# EAGLE design Project-PowerSwitch-005 (EAGLE 7.7.0)

## Sheet 1 of 3
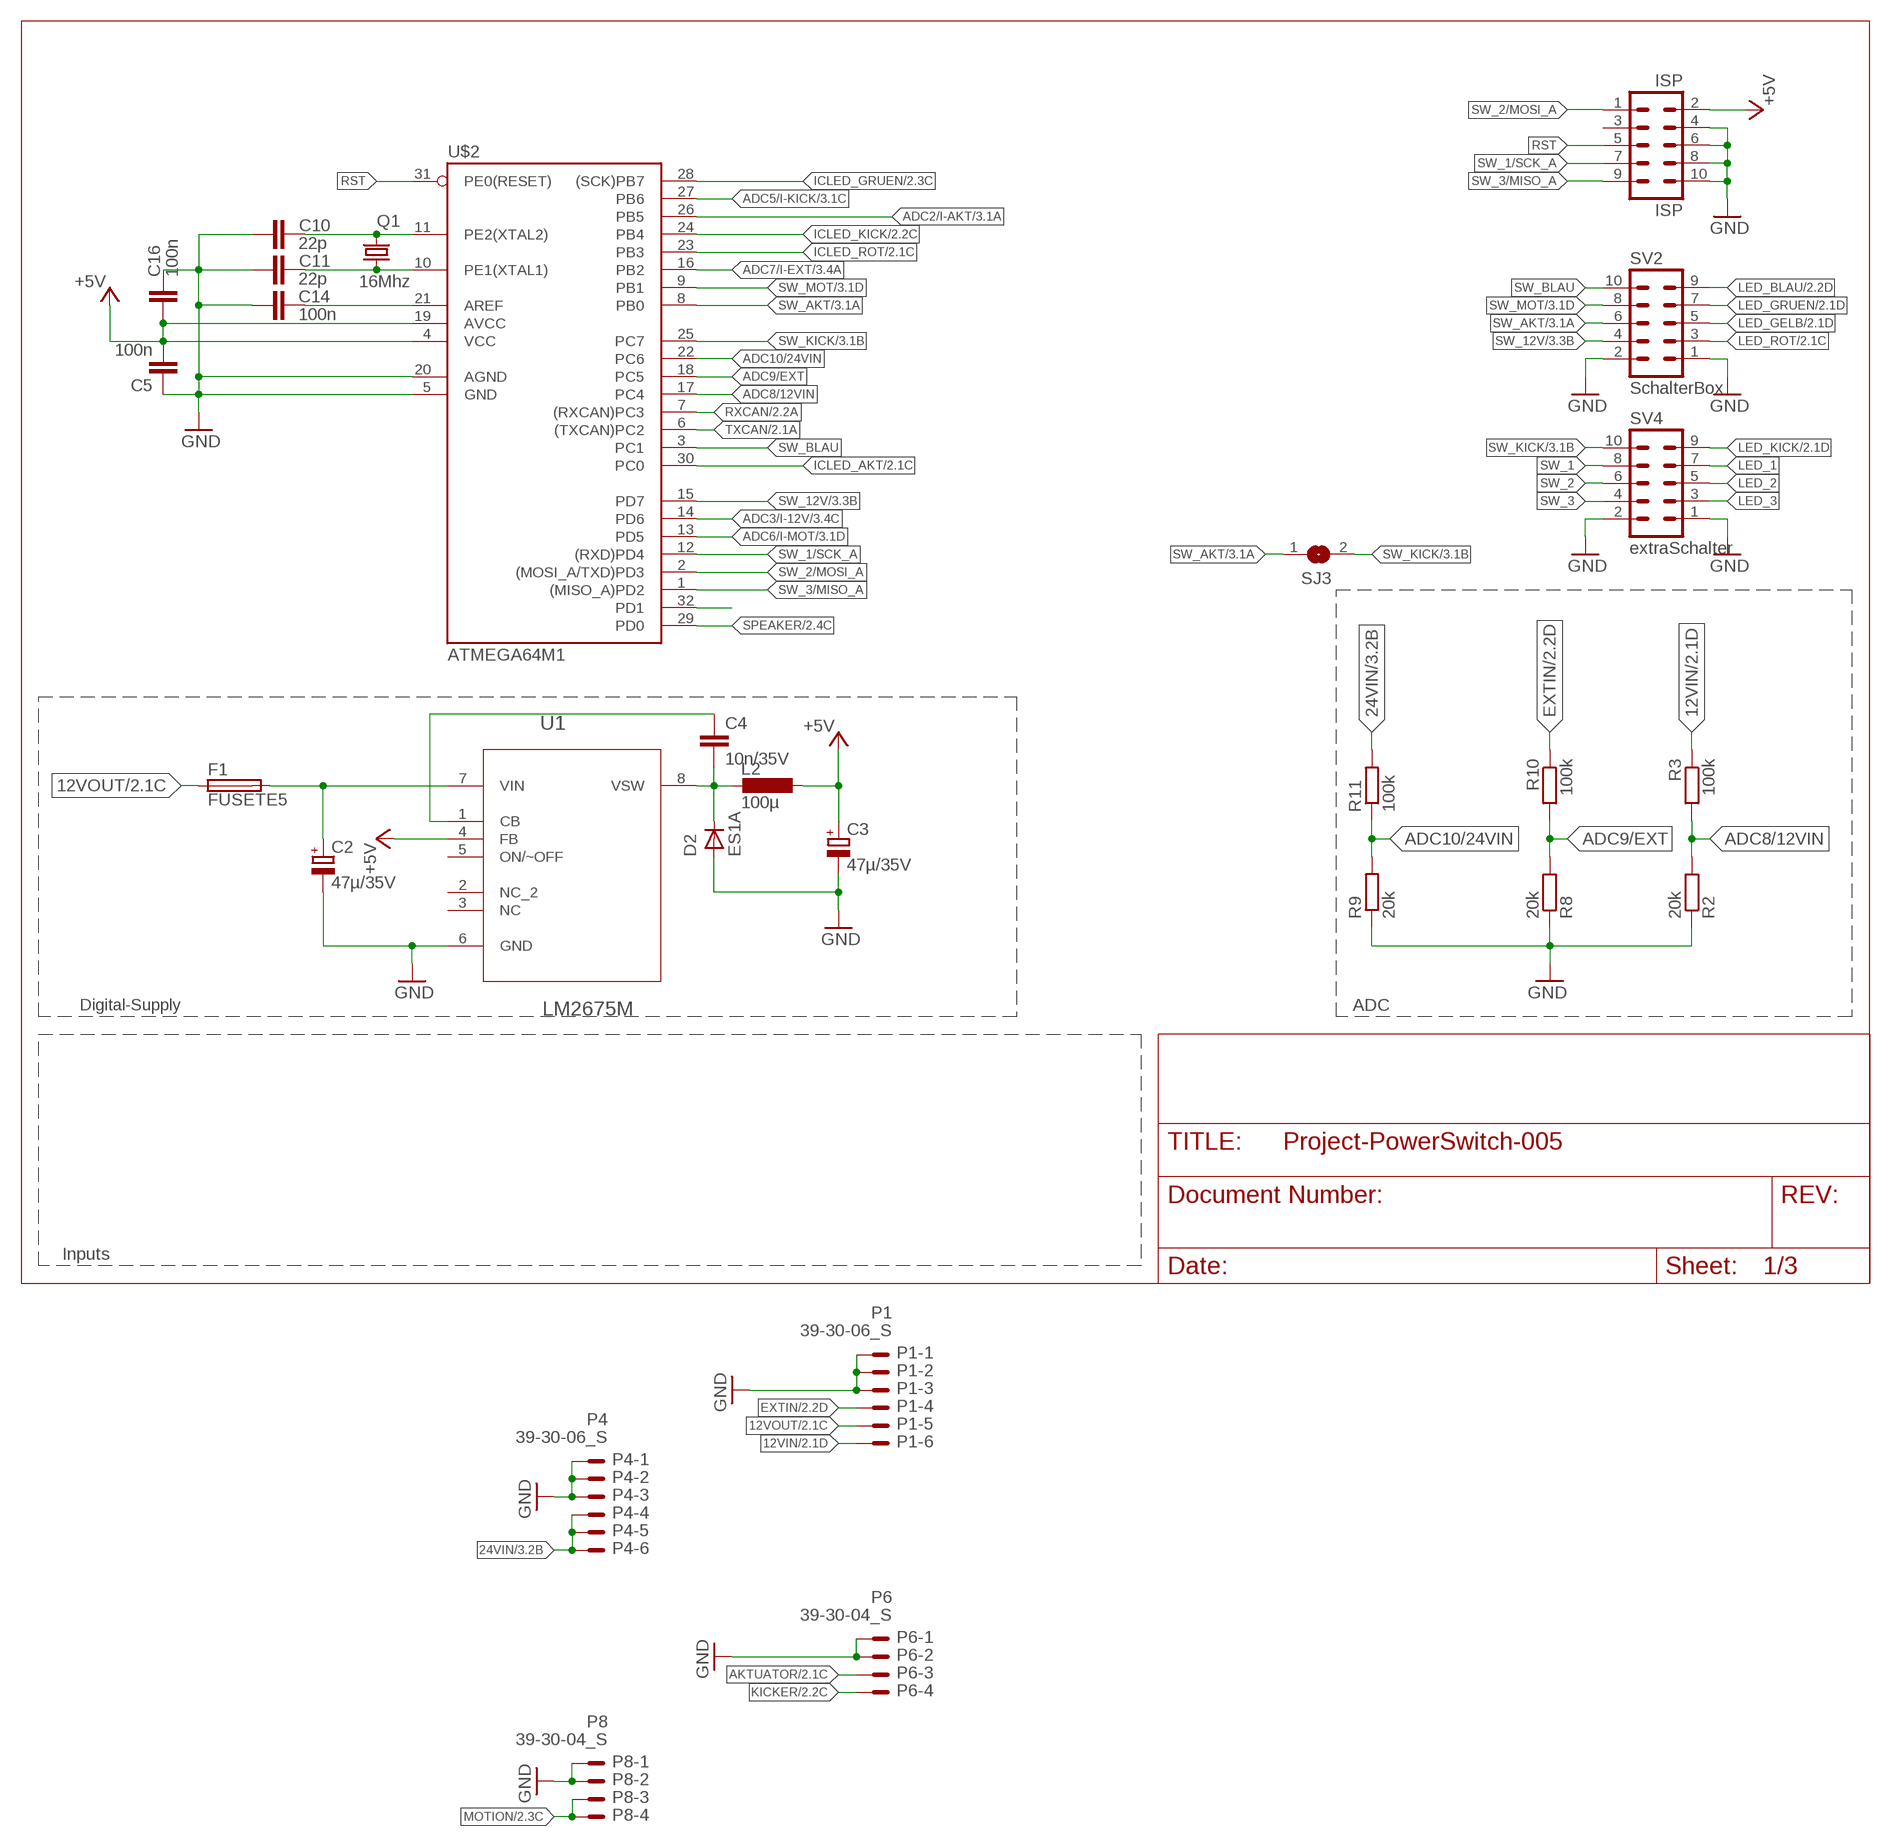
[diagram p0: schematic, sheet 1]

### Parts
C2  47µ/35V  CPOL-EUD  [PANASONIC_D]
C3  47µ/35V  CPOL-EUD  [PANASONIC_D]
C4  10n/35V  C-EUC0603  [C0603]
C5  100n  C-EUC0603  [C0603]
C10  22p  C-EUC0603  [C0603]
C11  22p  C-EUC0603  [C0603]
C14  100n  C-EUC0603  [C0603]
C16  100n  C-EUC0603  [C0603]
D2  ES1A  GF1  [SMA-DO214AC]
F1  FUSETE5  [TE5]
ISP  ISP  ML10  [ML10]
L2  100µ  L-EUPISM  [PISM]
P1  39-30-06_S  [39-30-?06?]
P4  39-30-06_S  [39-30-?06?]
P6  39-30-04_S  [39-30-?04?]
P8  39-30-04_S  [39-30-?04?]
Q1  16Mhz  CRYSTALHC49UP  [HC49UP]
R2  20k  R-EU_R0805  [R0805]
R3  100k  R-EU_R0805  [R0805]
R8  20k  R-EU_R0805  [R0805]
R9  20k  R-EU_R0805  [R0805]
R10  100k  R-EU_R0805  [R0805]
R11  100k  R-EU_R0805  [R0805]
SJ3  SJ  [SJ]
SV2  SchalterBox  ML10  [ML10]
SV4  extraSchalter  ML10  [ML10]
U1  LM2675M  LM2675M-3.3  [SOIC127P620X175-8N]
U$2  ATMEGA64M1  [TQFP32-08]

### Nets
12VIN: P1.6 R3.1 ; also sheet 2,3
12VOUT: F1.1 P1.5 ; also sheet 2,3
24VIN: P4.4 P4.5 P4.6 R11.2 ; also sheet 3
+5V: C3.+ C5.2 C16.1 ISP.2 L2.1 U1.4(FB) U$2.4(VCC) U$2.19(AVCC) ; also sheet 2
ADC2/I-AKT: U$2.26(PB5) ; also sheet 3
ADC3/I-12V: U$2.14(PD6) ; also sheet 3
ADC5/I-KICK: U$2.27(PB6) ; also sheet 3
ADC6/I-MOT: U$2.13(PD5) ; also sheet 3
ADC7/I-EXT: U$2.16(PB2) ; also sheet 3
ADC8/12VIN: R2.2 R3.2 U$2.17(PC4)
ADC9/EXT: R8.2 R10.2 U$2.18(PC5)
ADC10/24VIN: R9.2 R11.1 U$2.22(PC6)
AKTUATOR: P6.3 ; also sheet 2,3
EXTIN: P1.4 R10.1 ; also sheet 2,3
GND: C2.- C3.- C5.1 C10.1 C11.1 C14.1 C16.2 D2.A ISP.4 ISP.6 ISP.8 ISP.10 P1.1 P1.2 P1.3 P4.1 P4.2 P4.3 P6.1 P6.2 P8.1 P8.2 R2.1 R8.1 R9.1 SV2.1 SV2.2 SV4.1 SV4.2 U1.6(GND) U$2.5(GND) U$2.20(AGND) ; also sheet 2,3
ICLED_AKT: U$2.30(PC0) ; also sheet 2
ICLED_GRUEN: U$2.28((SCK)PB7) ; also sheet 2
ICLED_KICK: U$2.24(PB4) ; also sheet 2
ICLED_ROT: U$2.23(PB3) ; also sheet 2
KICKER: P6.4 ; also sheet 2,3
LED_1: SV4.7
LED_2: SV4.5
LED_3: SV4.3
LED_BLAU: SV2.9 ; also sheet 2
LED_GELB: SV2.5 ; also sheet 2
LED_GRUEN: SV2.7 ; also sheet 2
LED_KICK: SV4.9 ; also sheet 2
LED_ROT: SV2.3 ; also sheet 2
MOTION: P8.3 P8.4 ; also sheet 2,3
N$3: U$2.32(PD1)
N$10: C10.2 Q1.2 U$2.11(PE2(XTAL2))
N$11: C11.2 Q1.1 U$2.10(PE1(XTAL1))
N$13: C14.2 U$2.21(AREF)
N$22: C2.+ F1.2 U1.7(VIN)
N$27: C4.2 D2.K(C) L2.2 U1.8(VSW)
N$29: C4.1 U1.1(CB)
RST: ISP.5 U$2.31(PE0(RESET))
RXCAN: U$2.7((RXCAN)PC3) ; also sheet 2
SPEAKER: U$2.29(PD0) ; also sheet 2
SW_1: SV4.8
SW_1/SCK_A: ISP.7 U$2.12((RXD)PD4)
SW_2: SV4.6
SW_2/MOSI_A: ISP.1 U$2.2((MOSI_A/TXD)PD3)
SW_3: SV4.4
SW_3/MISO_A: ISP.9 U$2.1((MISO_A)PD2)
SW_12V: SV2.4 U$2.15(PD7) ; also sheet 3
SW_AKT: SJ3.1 SV2.6 U$2.8(PB0) ; also sheet 3
SW_BLAU: SV2.10 U$2.3(PC1)
SW_KICK: SJ3.2 SV4.10 U$2.25(PC7) ; also sheet 3
SW_MOT: SV2.8 U$2.9(PB1) ; also sheet 3
TXCAN: U$2.6((TXCAN)PC2) ; also sheet 2
Unconnected: ISP.3 U1.2(NC_2) U1.3(NC) U1.5(ON/~OFF)

### Notes on the sheet
- Digital-Supply | ADC
- Inputs

## Sheet 2 of 3
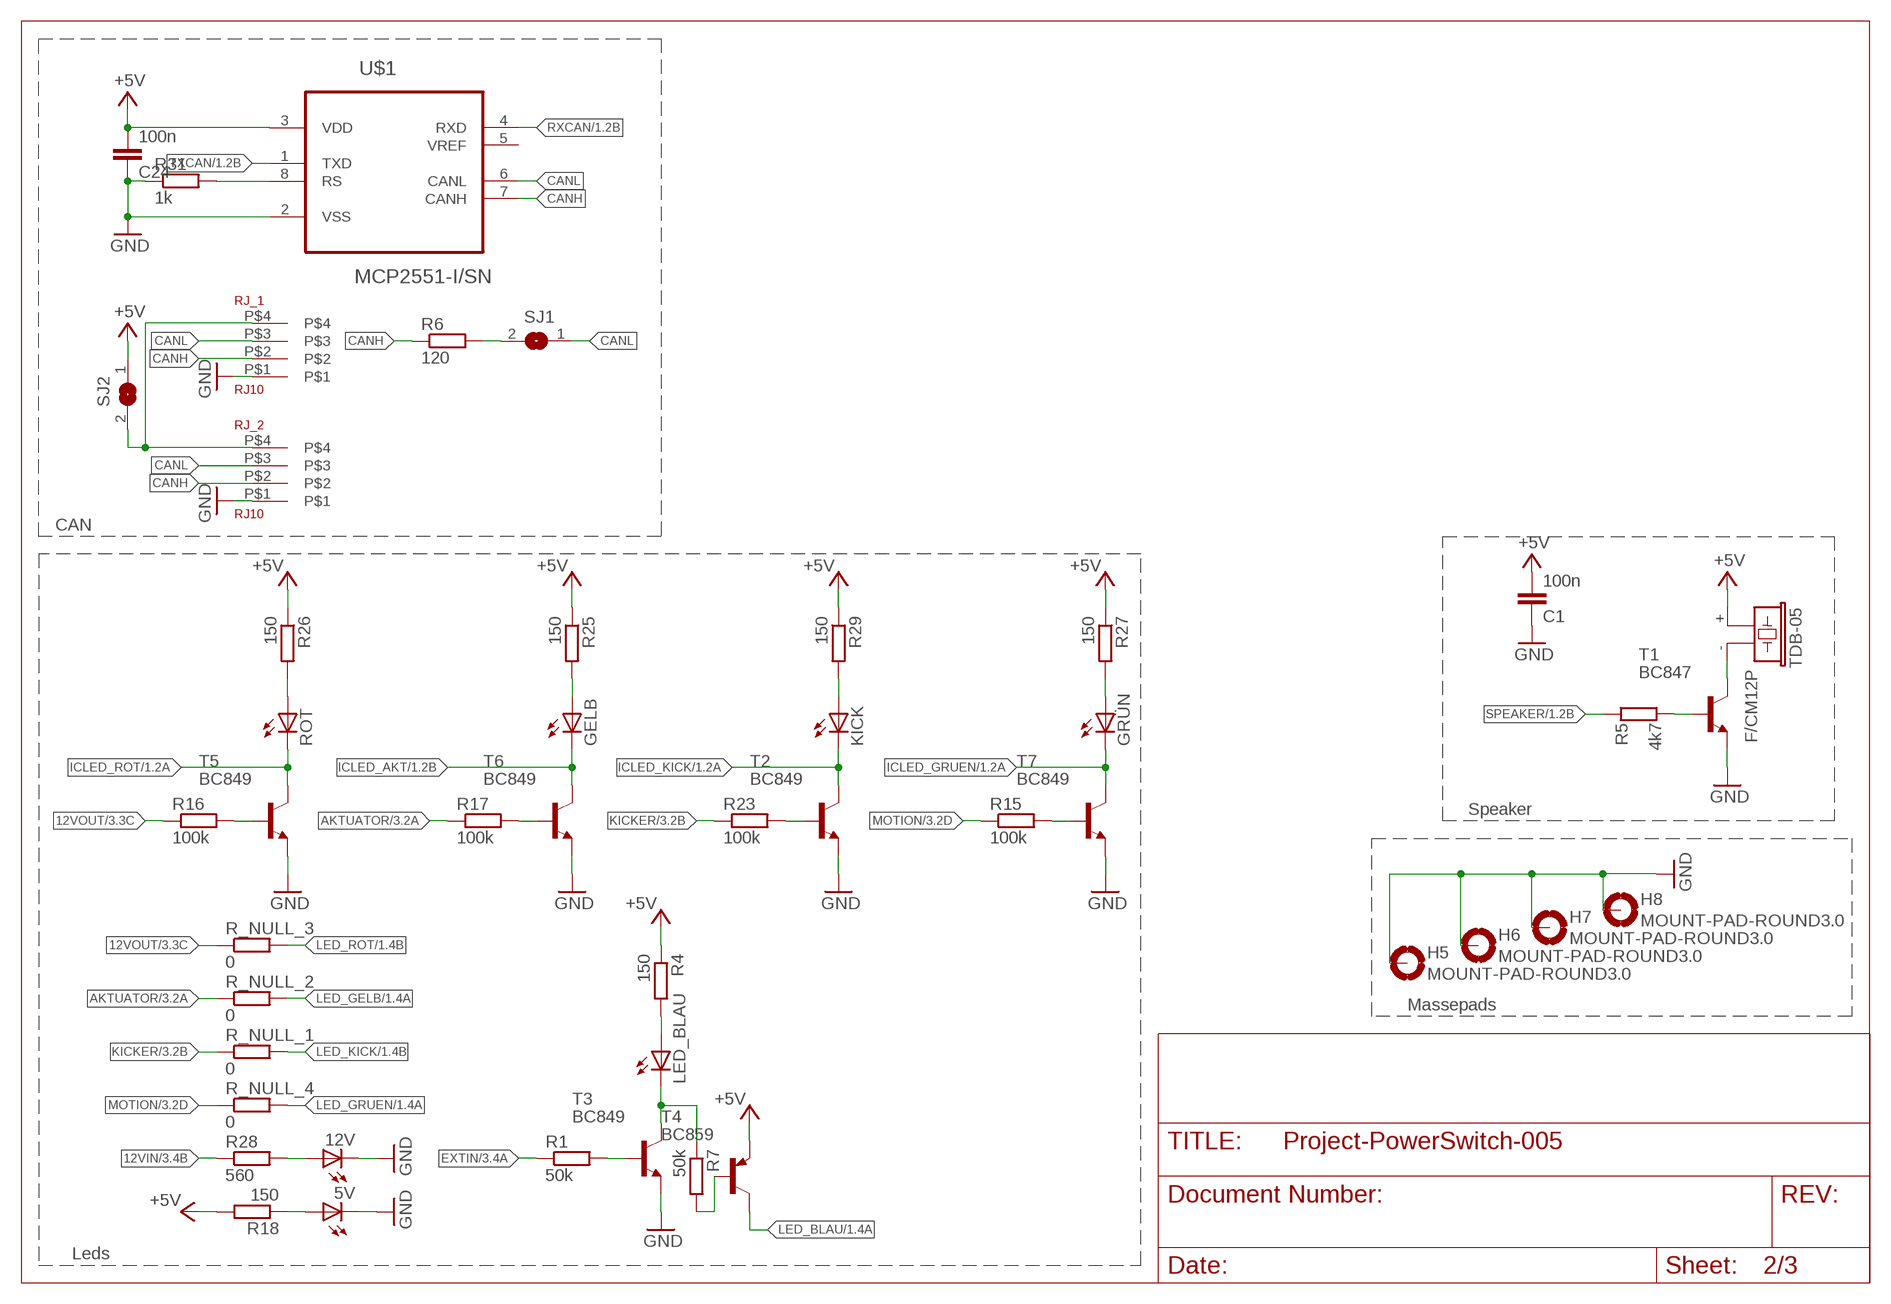
[diagram p1: schematic, sheet 2]

### Parts
5V  LEDCHIPLED_0805  [CHIPLED_0805]
12V  LEDCHIPLED_0805  [CHIPLED_0805]
C1  100n  C-EUC0603  [C0603]
C24  100n  C-EUC0603  [C0603]
GELB  LEDCHIPLED_0805  [CHIPLED_0805]
GRÜN  LEDCHIPLED_0805  [CHIPLED_0805]
H5  MOUNT-PAD-ROUND3.0  [3,0-PAD]
H6  MOUNT-PAD-ROUND3.0  [3,0-PAD]
H7  MOUNT-PAD-ROUND3.0  [3,0-PAD]
H8  MOUNT-PAD-ROUND3.0  [3,0-PAD]
KICK  LEDCHIPLED_0805  [CHIPLED_0805]
LED_BLAU  LEDCHIPLED_0805  [CHIPLED_0805]
R1  50k  R-EU_R0805  [R0805]
R4  150  R-EU_R0805  [R0805]
R5  4k7  R-EU_R0805  [R0805]
R6  120  R-EU_M0805  [M0805]
R7  50k  R-EU_R0805  [R0805]
R15  100k  R-EU_R0805  [R0805]
R16  100k  R-EU_R0805  [R0805]
R17  100k  R-EU_R0805  [R0805]
R18  150  R-EU_R0805  [R0805]
R23  100k  R-EU_R0805  [R0805]
R25  150  R-EU_R0805  [R0805]
R26  150  R-EU_R0805  [R0805]
R27  150  R-EU_R0805  [R0805]
R28  560  R-EU_R0805  [R0805]
R29  150  R-EU_R0805  [R0805]
R31  1k  R-EU_R0805  [R0805]
R_NULL_1  0  R-EU_R0402  [R0402]
R_NULL_2  0  R-EU_R0402  [R0402]
R_NULL_3  0  R-EU_R0402  [R0402]
R_NULL_4  0  R-EU_R0402  [R0402]
RJ_1  RJ10  [RJ10]
RJ_2  RJ10  [RJ10]
ROT  LEDCHIPLED_0805  [CHIPLED_0805]
SJ1  SJ  [SJ]
SJ2  SJ  [SJ]
T1  BC847  [SOT23]
T2  BC849  [SOT23]
T3  BC849  [SOT23]
T4  BC859  BC858C-PNP-SOT23-BEC  [SOT23-BEC]
T5  BC849  [SOT23]
T6  BC849  [SOT23]
T7  BC849  [SOT23]
TDB-05  F/CM12P  [F/CM12P]
U$1  MCP2551-I/SN  [SOIC127P600X175-8N]

### Nets
12VIN: R28.1 ; also sheet 1,3
12VOUT: R16.1 R_NULL_3.1 ; also sheet 1,3
+5V: C1.2 C24.2 R4.1 R18.2 R25.1 R26.1 R27.1 R29.1 SJ2.1 T4.E TDB-05.+ U$1.3(VDD) ; also sheet 1
AKTUATOR: R17.1 R_NULL_2.1 ; also sheet 1,3
CANH: R6.1 RJ_1.P$2 RJ_2.P$2 U$1.7(CANH)
CANL: RJ_1.P$3 RJ_2.P$3 SJ1.1 U$1.6(CANL)
EXTIN: R1.1 ; also sheet 1,3
GND: 5V.C 12V.C C1.1 C24.1 H5.B3,0(MOUNT) H6.B3,0(MOUNT) H7.B3,0(MOUNT) H8.B3,0(MOUNT) R31.1 RJ_1.P$1 RJ_2.P$1 T1.2(E) T2.2(E) T3.2(E) T5.2(E) T6.2(E) T7.2(E) U$1.2(VSS) ; also sheet 1,3
ICLED_AKT: GELB.C T6.3(C) ; also sheet 1
ICLED_GRUEN: GRÜN.C T7.3(C) ; also sheet 1
ICLED_KICK: KICK.C T2.3(C) ; also sheet 1
ICLED_ROT: ROT.C T5.3(C) ; also sheet 1
KICKER: R23.1 R_NULL_1.1 ; also sheet 1,3
LED_BLAU: T4.C ; also sheet 1
LED_GELB: R_NULL_2.2 ; also sheet 1
LED_GRUEN: R_NULL_4.2 ; also sheet 1
LED_KICK: R_NULL_1.2 ; also sheet 1
LED_ROT: R_NULL_3.2 ; also sheet 1
MOTION: R15.1 R_NULL_4.1 ; also sheet 1,3
N$1: R5.2 T1.1(B)
N$2: RJ_1.P$4 RJ_2.P$4 SJ2.2
N$4: R23.2 T2.1(B)
N$5: KICK.A R29.2
N$6: R31.2 U$1.8(RS)
N$7: R6.2 SJ1.2
N$8: GELB.A R25.2
N$9: R26.2 ROT.A
N$14: R1.2 T3.1(B)
N$15: LED_BLAU.A R4.2
N$16: LED_BLAU.C R7.1 T3.3(C)
N$17: R7.2 T4.B
N$20: T1.3(C) TDB-05.-
N$21: GRÜN.A R27.2
N$24: 12V.A R28.2
N$102: R16.2 T5.1(B)
N$104: R17.2 T6.1(B)
N$106: R15.2 T7.1(B)
N$108: 5V.A R18.1
RXCAN: U$1.4(RXD) ; also sheet 1
SPEAKER: R5.1 ; also sheet 1
TXCAN: U$1.1(TXD) ; also sheet 1
Unconnected: U$1.5(VREF)

### Notes on the sheet
- CAN
- Speaker
- Massepads
- Leds

## Sheet 3 of 3
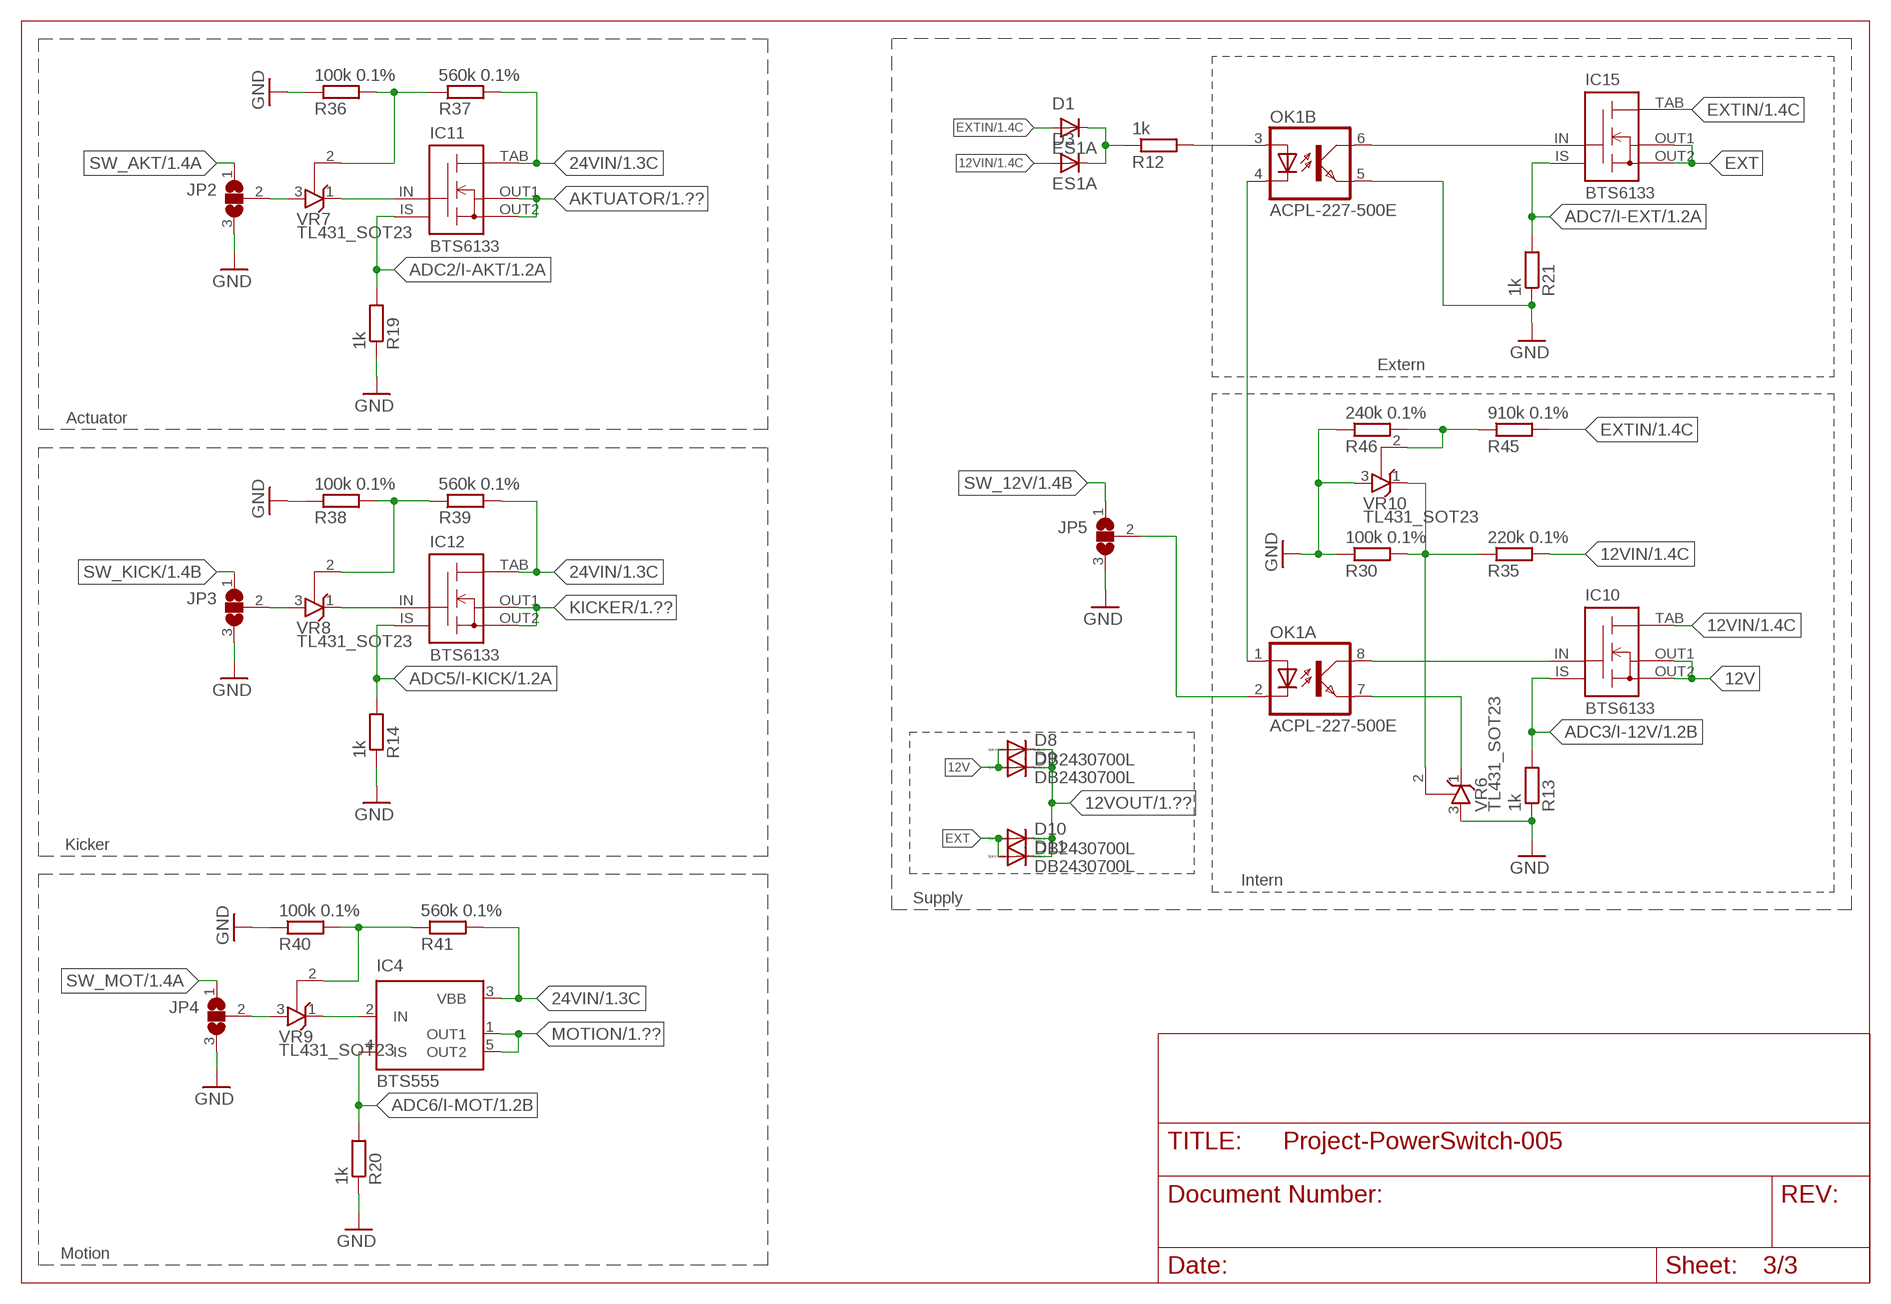
[diagram p2: schematic, sheet 3]

### Parts
D1  ES1A  GF1  [SMA-DO214AC]
D3  ES1A  GF1  [SMA-DO214AC]
D8  DB2430700L  [TMINIP2-F2-B]
D9  DB2430700L  [TMINIP2-F2-B]
D10  DB2430700L  [TMINIP2-F2-B]
D11  DB2430700L  [TMINIP2-F2-B]
IC4  BTS555  [TO220-51]
IC10  BTS6133  [TO252-51]
IC11  BTS6133  [TO252-51]
IC12  BTS6133  [TO252-51]
IC15  BTS6133  [TO252-51]
JP2  SJ2W  [SJ_2]
JP3  SJ2W  [SJ_2]
JP4  SJ2W  [SJ_2]
JP5  SJ2W  [SJ_2]
OK1  ACPL-227-500E  ILD207  [SOIC08]
R12  1k  R-EU_R0805  [R0805]
R13  1k  R-EU_R0805  [R0805]
R14  1k  R-EU_R0805  [R0805]
R19  1k  R-EU_R0805  [R0805]
R20  1k  R-EU_R0805  [R0805]
R21  1k  R-EU_R0805  [R0805]
R30  100k 0.1%  R-EU_R0805  [R0805]
R35  220k 0.1%  R-EU_R0805  [R0805]
R36  100k 0.1%  R-EU_R0805  [R0805]
R37  560k 0.1%  R-EU_R0805  [R0805]
R38  100k 0.1%  R-EU_R0805  [R0805]
R39  560k 0.1%  R-EU_R0805  [R0805]
R40  100k 0.1%  R-EU_R0805  [R0805]
R41  560k 0.1%  R-EU_R0805  [R0805]
R45  910k 0.1%  R-EU_R0805  [R0805]
R46  240k 0.1%  R-EU_R0805  [R0805]
VR6  TL431_SOT23  [SOT23]
VR7  TL431_SOT23  [SOT23]
VR8  TL431_SOT23  [SOT23]
VR9  TL431_SOT23  [SOT23]
VR10  TL431_SOT23  [SOT23]

### Nets
12V: D8.A D9.A IC10.OUT1(OUT) IC10.OUT2(OUT)
12VIN: D3.A IC10.TAB(VBB) R35.2 ; also sheet 1,2
12VOUT: D8.C D9.C D10.C D11.C ; also sheet 1,2
24VIN: IC4.3(VBB) IC11.TAB(VBB) IC12.TAB(VBB) R37.2 R39.2 R41.2 ; also sheet 1
ADC2/I-AKT: IC11.IS R19.2 ; also sheet 1
ADC3/I-12V: IC10.IS R13.2 ; also sheet 1
ADC5/I-KICK: IC12.IS R14.2 ; also sheet 1
ADC6/I-MOT: IC4.4(IS) R20.2 ; also sheet 1
ADC7/I-EXT: IC15.IS R21.2 ; also sheet 1
AKTUATOR: IC11.OUT1(OUT) IC11.OUT2(OUT) ; also sheet 1,2
EXT: D10.A D11.A IC15.OUT1(OUT) IC15.OUT2(OUT)
EXTIN: D1.A IC15.TAB(VBB) R45.2 ; also sheet 1,2
GND: JP2.3 JP3.3 JP4.3 JP5.3 OK1.5(B:EMIT) R13.1 R14.1 R19.1 R20.1 R21.1 R30.1 R36.1 R38.1 R40.1 R46.1 VR6.3(A) VR10.3(A) ; also sheet 1,2
KICKER: IC12.OUT1(OUT) IC12.OUT2(OUT) ; also sheet 1,2
MOTION: IC4.1(OUT1) IC4.5(OUT2) ; also sheet 1,2
N$12: JP2.2 VR7.3(A)
N$18: JP5.2 OK1.2(A:C)
N$19: JP3.2 VR8.3(A)
N$23: JP4.2 VR9.3(A)
N$25: D1.K(C) D3.K(C) R12.1
N$26: OK1.1(A:A) OK1.4(B:C)
N$28: OK1.3(B:A) R12.2
N$30: OK1.7(A:EMIT) VR6.1(C)
N$31: IC15.IN OK1.6(B:COL)
N$32: IC10.IN OK1.8(A:COL)
N$33: R30.2 R35.1 VR6.2(R) VR10.1(C)
N$36: IC12.IN VR8.1(C)
N$37: IC4.2(IN) VR9.1(C)
N$40: IC11.IN VR7.1(C)
N$42: R36.2 R37.1 VR7.2(R)
N$44: R38.2 R39.1 VR8.2(R)
N$45: R40.2 R41.1 VR9.2(R)
N$50: R45.1 R46.2 VR10.2(R)
SW_12V: JP5.1 ; also sheet 1
SW_AKT: JP2.1 ; also sheet 1
SW_KICK: JP3.1 ; also sheet 1
SW_MOT: JP4.1 ; also sheet 1

### Notes on the sheet
- Extern
- Actuator
- Kicker
- Intern
- Supply
- Motion

## Library data of the parts
5V 12V GELB GRÜN KICK LED_BLAU ROT = led:LED: LED OSRAM: - CHIPLED LG R971, LG N971, LY N971, LG Q971, LY Q971, LO R971, LY R971 LH N974, LH R974 LS Q976, LO Q976, LY Q976 LO Q996 - Hyper CHIPLED LW Q18S LB Q993, LB Q99A, LB R99A - SideLED LS A670, LO A670, LY A670, LG A670, LP A670 LB A673, LV A673, LT A673, LW A673 LH A674 LY A675 LS A676, LA A676, LO A676, LY A676, LW A676 LS A679, LY A679, LG A679 - Hyper Micro SIDELED® LS Y876, LA Y876, LO Y876, LY Y876 LT Y87S - SmartLED LW L88C, LW L88S LB L89C, LB L89S, LG L890 LS L89K, LO L89K, LY L89K LS L896, LA L896, LO L896, LY L896 - TOPLED LS T670, LO T670, LY T670, LG T670, LP T670 LSG T670, LSP T670, LSY T670, LOP T670, LYG T670 LG T671, LOG T671, LSG T671 LB T673, LV T673, LT T673, LW T673 LH T674 LS T676, LA T676, LO T676, LY T676, LB T676, LH T676, LSB T676, LW T676 LB T67C, LV T67C, LT T67C, LS T67K, LO T67K, LY T67K, LW E67C LS E67B, LA E67B, LO E67B, LY E67B, LB E67C, LV E67C, LT E67C LW T67C LS T679, LY T679, LG T679 LS T770, LO T770, LY T770, LG T770, LP T770 LB T773, LV T773, LT T773, LW T773 LH T774 LS E675, LA E675, LY E675, LS T675 LS T776, LA T776, LO T776, LY T776, LB T776 LHGB T686 LT T68C, LB T68C - Hyper Mini TOPLED® LB M676 - Mini TOPLED Santana® LG M470 LS M47K, LO M47K, LY M47K Source: http://www.osram.convergy.de LUXEON: - LUMILED® LXK2-PW12-R00, LXK2-PW12-S00, LXK2-PW14-U00, LXK2-PW14-V00 LXK2-PM12-R00, LXK2-PM12-S00, LXK2-PM14-U00 LXK2-PE12-Q00, LXK2-PE12-R00, LXK2-PE12-S00, LXK2-PE14-T00, LXK2-PE14-U00 LXK2-PB12-K00, LXK2-PB12-L00, LXK2-PB12-M00, LXK2-PB14-N00, LXK2-PB14-P00, LXK2-PB14-Q00 LXK2-PR12-L00, LXK2-PR12-M00, LXK2-PR14-Q00, LXK2-PR14-R00 LXK2-PD12-Q00, LXK2-PD12-R00, LXK2-PD12-S00 LXK2-PH12-R00, LXK2-PH12-S00 LXK2-PL12-P00, LXK2-PL12-Q00, LXK2-PL12-R00 Source: www.luxeon.com KINGBRIGHT: KA-3528ASYC Source: www.kingbright.com
C1 C4 C5 C10 C11 C14 C16 C24 = rcl:C-EU: CAPACITOR, European symbol
C2 C3 = rcl:CPOL-EU: POLARIZED CAPACITOR, European symbol
D1-D3 = diode:GF1: DIODE
D8-D11 = DB2430700L:DB2430700L
F1 = fuse:FUSE: Fuse; OC_FARNELL: unknown; OC_NEWARK: unknown
H5-H8 = holes:MOUNT-PAD-ROUND: MOUNTING PAD, round
IC4 = micro-siemens:BTS555: Smart Highside High Current Power Switch PROFET® Source: http://www.infineon.com/upload/Document/cmc_upload/documents/011/8726/Datasheet_BTS555.pdf; MF: FARNELL; MPN: BTS555.; OC_FARNELL: 4109260; OC_NEWARK: 26H6766
IC10-IC12 IC15 = BTS443P:BTS6133
ISP SV2 SV4 = con-ml:ML10: HARTING; OC_FARNELL: unknown; OC_NEWARK: unknown
JP2-JP5 = jumper:SJ2W: SMD solder JUMPER
L2 = Inductor-Fastron:L-EU
OK1 = optocoupler:ILD2*: Siemens ILD205/206/207/211/213/217 DUAL PHOTOTRANSISTOR SMALL OUTLINE SURFACE MOUNT OPTOCOUPLER Source: 153385-da-01-en-Optocoupler_ILD205-T.pdf; MF: VISHAY/TELEFUNKEN; MPN: ILD207T; OC_FARNELL: 1469603; OC_NEWARK: 97C8648
P1 P4 = con-molex-mini-fit:39-30-?06?_S: HEADER
P6 P8 = con-molex-mini-fit:39-30-?04?_S: HEADER
Q1 = crystal:CRYSTAL: CRYSTAL; OC_FARNELL: unknown; OC_NEWARK: unknown
R1-R21 R23 R25-R31 R35-R41 R45 R46 R_NULL_1-R_NULL_4 = rcl:R-EU_: RESISTOR, European symbol
RJ_1 RJ_2 = ownParts:RJ10
SJ1-SJ3 = jumper:SJ: SMD solder JUMPER
T1 = transistor:BC847: NPN TRANSISTOR
T2 T3 T5-T7 = transistor:BC849: NPN TRANSISTOR
T4 = transistor:*-PNP-: PNP Transistror
TDB-05 = buzzer:F/CM12P: BUZZER Source: Buerklin; OC_FARNELL: unknown; OC_NEWARK: unknown
U1 = LM2675:LM2675M-3.3: Step-Down Voltage Regulator; MPN: LM2675M-3.3; OC_FARNELL: 9489800; OC_NEWARK: 41K4140; PACKAGE: 8-SOIC; SUPPLIER: National Semiconductors
U$1 = Microchip-MCP2551-I_SN:MCP2551-I/SN: High-Speed CAN Transceiver; MPN: MCP2551-I/SN; OC_FARNELL: 9758569; OC_NEWARK: 69K7604; PACKAGE: SOIC-8; SUPPLIER: Microchip
U$2 = atmega16m1-32m1-64m1:ATMEGA64M1
VR6-VR10 = 1_USER:TL431

## Board
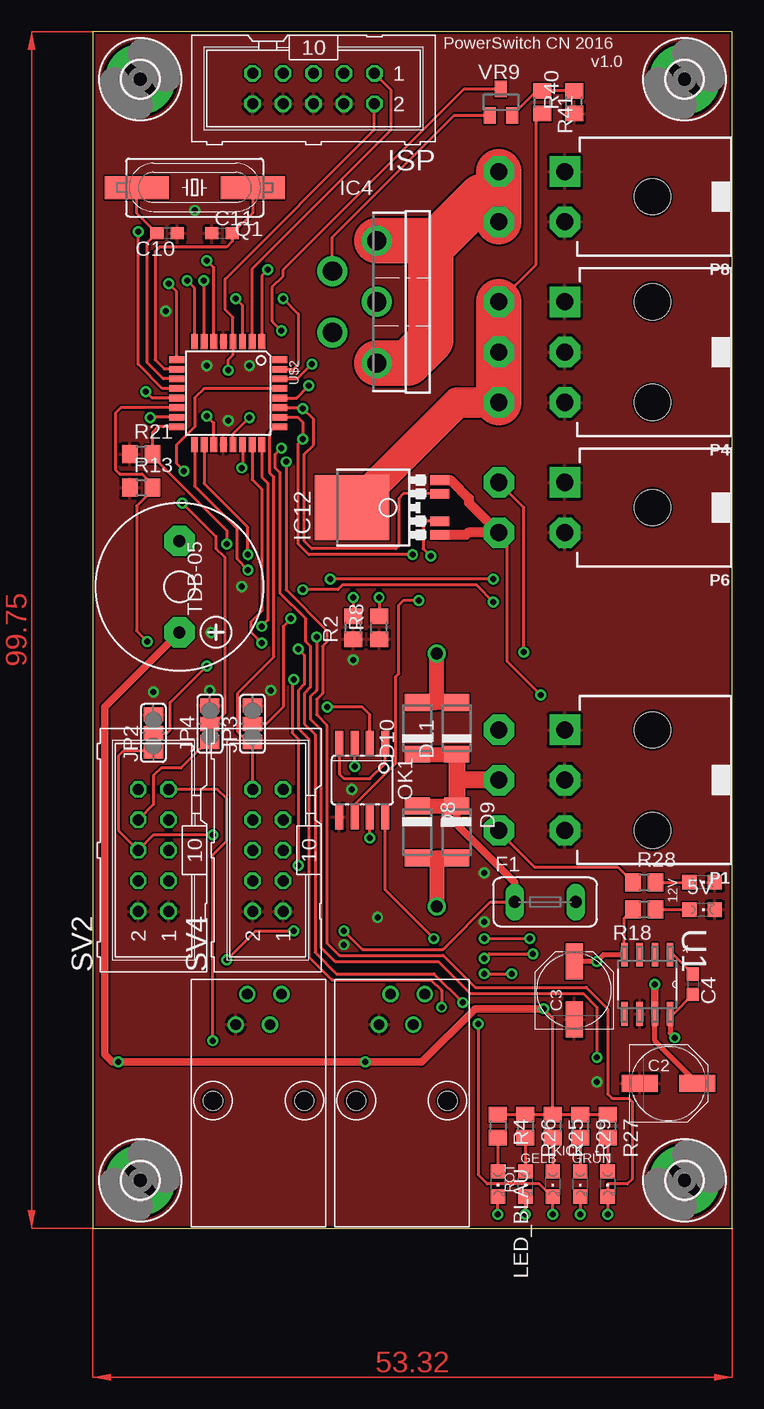
[diagram p3: board, top side]
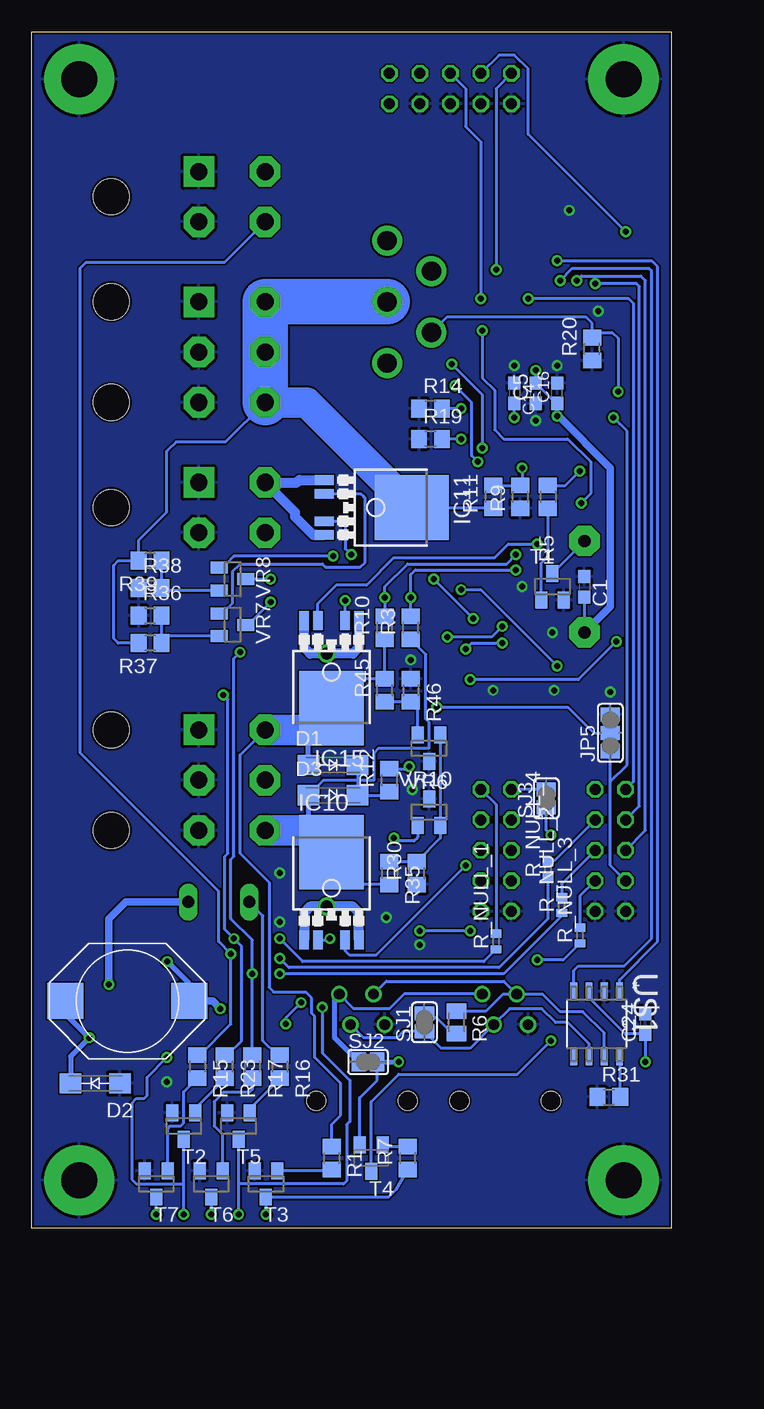
[diagram p4: board, bottom side, seen from below]

Size 53.32 x 99.75 mm. Coordinates in mm from the lower left corner, seen from the top.
Outline: 0,0 53.32,0 53.32,99.75 0,99.75 0,0
Copper layers (1+2*15+16): Top 0.035mm / dielectric 0.36mm / Route2 0.018mm / dielectric 0.71mm / Route15 0.018mm / dielectric 0.36mm / Bottom 0.035mm
Design rules "qp_designrules_6mil": minimum track width 6mil, minimum drill 0.3mm, track to track 6mil, track to pad 6mil, pad to pad 6mil, via to via 6mil, smd to smd 6mil, copper to edge 8mil, drill to drill 10mil, minimum pad ring 8mil, minimum via ring 8mil, stop-mask expansion 2mil, vias tented up to drill 16mil, thermal gap 10mil

### Footprints (pad centres in the part's own frame; a part is rotated, then mirrored left to right if it is on the bottom)
CHIPLED_0805 = smd 1.2 x 1.2: A 0,-1.05; C 0,1.05
C0603 = smd 1.1 x 1: 1 -0.85,0; 2 0.85,0
PANASONIC_D = smd 3 x 1.4: + 2.4,0; - -2.4,0
SMA-DO214AC = smd 1.8 x 1.7: A -2.05,0; K 2.05,0
TMINIP2-F2-B = smd 1.4 x 2.1: A 2.159,0; C -2.159,0
TE5 = drill 1.016 long: 1 -2.54,0; 2 2.54,0
3,0-PAD = drill 3 pad 5.842: B3,0 0,0
TO220-51 = drill 1.6 pad 2.5: 1 -5.1,-4.5; 2 -2.55,-8.2; 3 0,-4.5; 4 2.55,-8.2; 5 5.1,-4.5
TO252-51 = smd 0.8 x 1.6: IN -1.14,-4.8; IS 1.14,-4.8; OUT1 -2.28,-4.8; OUT2 2.28,-4.8 | smd 5.4 x 6.2: TAB 0,2.5
ML10 = drill 0.914 octagon: 1 -5.08,-1.27; 2 -5.08,1.27; 3 -2.54,-1.27; 4 -2.54,1.27; 5 0,-1.27; 6 0,1.27; 7 2.54,-1.27; 8 2.54,1.27; 9 5.08,-1.27; 10 5.08,1.27
SJ_2 = smd 1.168 x 1.6: 1 -1.524,0; 2 0,0; 3 1.524,0
PISM = smd 3 x 3: 1 -5.15,0; 2 5.15,0
SOIC08 = smd 0.66 x 2.032: 1 -1.905,-3.073; 2 -0.635,-3.073; 3 0.635,-3.073; 4 1.905,-3.073; 5 1.905,3.073; 6 0.635,3.073; 7 -0.635,3.073; 8 -1.905,3.073
39-30-?06? = drill 1.422 pad 2.54 square: 1 4.191,0 | drill 1.422 pad 2.54 octagon: 2 0,0; 3 -4.191,0; 4 4.191,5.512; 5 0,5.512; 6 -4.191,5.512 | hole 3: -4.191,-7.3; 4.191,-7.3
39-30-?04? = drill 1.422 pad 2.54 square: 1 2.095,0 | drill 1.422 pad 2.54 octagon: 2 -2.095,0; 3 2.095,5.512; 4 -2.095,5.512 | hole 3: 0,-7.3
HC49UP = smd 5.334 x 1.93: 1 -4.826,0; 2 4.826,0
R0805 = smd 1.3 x 1.5: 1 -0.95,0; 2 0.95,0
M0805 = smd 1.3 x 1.6: 1 -0.95,0; 2 0.95,0
R0402 = smd 0.7 x 0.9: 1 -0.65,0; 2 0.65,0
RJ10 = drill 0.9: P$1 -1.905,6.55; P$2 -0.953,9.09; P$3 0.953,6.55; P$4 1.905,9.09 | hole 1.59: -3.81,0.2; 3.81,0.2
SJ = smd 1.168 x 1.6: 1 -0.762,0; 2 0.762,0
SOT23 = smd 1 x 1.4: 1 -0.95,-1.1; 2 0.95,-1.1; 3 0,1.1
SOT23-BEC = smd 1 x 1.4: B -0.95,-1.1; C 0,1.1; E 0.95,-1.1
F/CM12P = drill 1.016 pad 2.54 octagon: + 3.81,0; - -3.81,0
SOIC127P620X175-8N = smd 1.981 x 0.559: 1 -2.464,1.905; 2 -2.464,0.635; 3 -2.464,-0.635; 4 -2.464,-1.905; 5 2.464,-1.905; 6 2.464,-0.635; 7 2.464,0.635; 8 2.464,1.905
SOIC127P600X175-8N = smd 1.473 x 0.559: 1 -2.718,1.905; 2 -2.718,0.635; 3 -2.718,-0.635; 4 -2.718,-1.905; 5 2.718,-1.905; 6 2.718,-0.635; 7 2.718,0.635; 8 2.718,1.905
TQFP32-08 = smd 1.27 x 0.559: 1 -4.293,2.8; 2 -4.293,2; 3 -4.293,1.2; 4 -4.293,0.4; 5 -4.293,-0.4; 6 -4.293,-1.2; 7 -4.293,-2; 8 -4.293,-2.8; 17 4.293,-2.8; 18 4.293,-2; 19 4.293,-1.2; 20 4.293,-0.4; 21 4.293,0.4; 22 4.293,1.2; 23 4.293,2; 24 4.293,2.8 | smd 0.559 x 1.27: 9 -2.8,-4.293; 10 -2,-4.293; 11 -1.2,-4.293; 12 -0.4,-4.293; 13 0.4,-4.293; 14 1.2,-4.293; 15 2,-4.293; 16 2.8,-4.293; 25 2.8,4.293; 26 2,4.293; 27 1.2,4.293; 28 0.4,4.293; 29 -0.4,4.293; 30 -1.2,4.293; 31 -2,4.293; 32 -2.8,4.293

### Placement (x,y rotation side)
5V  50.8,26.54 270 top
12V  50.8,28.83 270 top
C1  7.24,53.47 270 bottom
C2  48.01,12.06 0 top
C3  40.13,19.81 90 top
C4  50.04,20.32 270 top
C5  11.3,69.6 90 bottom
C10  6.22,82.93 180 top
C11  10.79,82.93 0 top
C14  13.08,69.6 270 bottom
C16  9.53,69.6 90 bottom
C24  2.16,17.02 270 bottom
D1  28.19,38.61 0 bottom
D2  48.01,12.06 180 bottom
D3  28.19,36.07 0 bottom
D8  27.05,33.02 270 top
D9  30.35,33.02 270 top
D10  27.05,41.66 90 top
D11  30.35,41.66 90 top
F1  37.72,27.18 0 top
GELB  38.35,3.68 180 top
GRÜN  42.93,3.68 180 top
H5  3.98,95.76 0 top
H6  49.33,95.76 0 top
H7  3.98,3.98 0 top
H8  49.33,3.98 0 top
IC4  28.19,77.22 270 top
IC10  28.32,28.83 0 bottom
IC11  24.13,60.07 270 bottom
IC12  24.13,60.07 90 top
IC15  28.32,45.85 180 bottom
ISP  18.41,95 180 top
JP2  5.08,41.27 90 top
JP3  13.34,42.04 90 top
JP4  9.78,42.04 90 top
JP5  5.08,41.27 90 bottom
KICK  40.64,3.68 180 top
L2  45.34,18.92 180 bottom
LED_BLAU  33.78,3.68 180 top
OK1  22.48,37.34 180 top
P1  39-30-06?_S  [39-30-?06?]  39.37,37.34 90 top
P4  39-30-06?_S  [39-30-?06?]  39.37,73.03 90 top
P6  39-30-04?_S  [39-30-?04?]  39.37,60.07 90 top
P8  39-30-04?_S  [39-30-?04?]  39.37,85.98 90 top
Q1  8.51,86.74 180 top
R1  28.32,5.84 270 bottom
R2  21.72,50.04 90 top
R3  21.72,50.04 90 bottom
R4  33.78,8.51 270 top
R5  10.29,60.96 270 bottom
R6  17.91,17.14 270 bottom
R7  21.97,5.84 90 bottom
R8  23.88,50.04 90 top
R9  12.57,60.96 90 bottom
R10  23.88,50.04 90 bottom
R11  14.86,60.96 270 bottom
R12  23.5,37.34 90 bottom
R13  4.06,61.72 0 top
R14  20.07,68.33 0 bottom
R15  39.5,13.46 270 bottom
R16  32.64,13.46 270 bottom
R17  34.92,13.46 270 bottom
R18  45.97,26.54 180 top
R19  20.07,65.79 0 bottom
R20  6.6,73.28 90 bottom
R21  4.06,64.52 0 top
R23  37.21,13.46 270 bottom
R25  38.35,8.51 270 top
R26  36.07,8.51 270 top
R27  42.93,8.51 270 top
R28  45.97,28.83 0 top
R29  40.64,8.51 270 top
R30  21.21,29.59 90 bottom
R31  5.21,10.92 0 bottom
R35  23.5,29.59 270 bottom
R36  43.43,51.05 0 bottom
R37  43.43,48.77 180 bottom
R38  43.43,53.34 0 bottom
R39  43.43,55.63 180 bottom
R40  40.13,93.85 90 top
R41  37.47,93.85 270 top
R45  23.88,44.83 90 bottom
R46  21.72,44.83 270 bottom
R_NULL_1  14.61,23.88 90 bottom
R_NULL_2  9.14,26.92 90 bottom
R_NULL_3  7.62,24.38 90 bottom
R_NULL_4  10.29,29.84 90 bottom
RJ_1  13.84,10.41 0 top
RJ_2  25.78,10.41 0 top
ROT  36.07,3.68 180 top
SJ1  20.57,17.14 90 bottom
SJ2  25.27,13.84 180 bottom
SJ3  10.41,35.81 90 bottom
SV2  5.08,31.5 90 top
SV4  14.61,31.5 90 top
T1  9.91,53.47 0 bottom
T2  40.64,8.51 180 bottom
T3  33.78,3.68 180 bottom
T4  25.02,5.84 180 bottom
T5  36.07,8.51 180 bottom
T6  38.35,3.68 180 bottom
T7  42.93,3.68 180 bottom
TDB-05  7.24,53.47 270 top
U1  46.23,20.32 270 top
U$1  6.22,17.02 270 bottom
U$2  11.3,69.6 270 top
VR6  20.19,34.67 0 bottom
VR7  36.58,50.29 270 bottom
VR8  36.58,54.1 270 bottom
VR9  34.04,93.85 0 top
VR10  20.19,40.01 180 bottom

### Tracks (layer width: path | path; a pad name or v marks a point on that pad's centre or on a via)
12V  (via drill 1)
  Top 1.27: D8.A 28.7,30.86 | D9.A 28.7,30.86 | 28.7,30.86 v28.7,26.8
  Bottom 0.813: IC10.OUT2 26.04,26.3 26.54,26.8 v28.7,26.8 29.46,26.8 30.1,26.8 30.61,26.29 IC10.OUT1
12VIN
  Top 0.254: P1.6 33.86,33.07 36.83,30.1 43.75,30.1 R28.1
  Bottom 0.254: R35.2 25.63,28.64 IC10.TAB | D3.A 28.97,37.34 24.77,37.34 24.77,39.62 24.38,40.01 20.19,40.01 20.19,42.16 20.45,42.42 20.45,47.82 R3.1
  Bottom 0.406: D3.A 30.24,33.26 30.35,33.15
  Bottom 2.54: P1.6 30.35,33.15 30.14,33.15 IC10.TAB
12VOUT  (via drill 0.5)
  Top 0.254: v11.18,22.35 13.59,24.77 v16.76,24.77 | v20.95,24.77 22.48,23.24 29.21,23.24 33.15,27.18 F1.1
  Top 0.61: F1.1 35.18,28.83 30.35,33.66 D9.C
  Top 1.27: D8.C D9.C | D10.C D11.C
  Top 1.422: D11.C 30.35,37.34 | 30.35,37.34 D9.C | P1.5 30.35,37.34
  Bottom 0.254: R_NULL_3.1 7.63,23.73 9.02,22.35 v11.18,22.35 | v16.76,24.77 v20.95,24.77 | R16.1 32.89,14.48 34.04,15.62 34.04,26.04 F1.1
  other vias: 35.18,27.18
24VIN
  Top 0.254: P4.4 36.96,80.31 36.96,92.58 37.28,92.9 R41.2
  Top 2.54: IC12.TAB 30.39,68.83 P4.6
  Top 3.81: P4.6 P4.4
  Bottom 0.254: R37.2 46.1,48.77 46.48,49.15 46.48,55.24 46.1,55.63 R39.2 44.38,57.34 42.04,59.69 42.04,64.77 41.91,64.9 41.27,65.53 37.16,65.53 P4.6 | R11.2 21.57,60.01 IC12.TAB
  Bottom 2.54: IC12.TAB 30.39,68.83 P4.6
  Bottom 3.81: P4.5 P4.4 IC4.3 | P4.6 33.86,72.95
+5V  (via drill 0.5)
  Top 0.254: U$2.19 10.1,67.11 v9.53,67.69 | v11.3,71.5 11.3,72.39 11.7,72.79 U$2.4 11.7,75.93 11.05,76.58 11.05,79.12 23.5,91.57 ISP.2 | U1.4 44.32,25.84 R18.2 | R27.1 R29.1 R25.1 | R25.1 38.35,17.53 v37.59,18.29 | R25.1 R26.1 R4.1
  Top 0.406: U1.4 42.6,22.78 v42.02,22.21 C3.+
  Top 0.61: v37.59,18.29 31.88,18.29 27.43,13.84 v22.73,13.84 v2.16,13.84 1.65,13.84 1.02,14.48 1.02,43.43 TDB-05.+
  Bottom 0.254: v9.53,67.69 C16.1 9.6,68.75 C5.2 v11.3,71.5 | U$1.3 6.86,19.18 3.85,16.17 C24.2 v2.16,13.84 | C1.2 TDB-05.+ | T4.E 25.97,10.86 24.51,12.32 SJ2.1
  Bottom 0.406: L2.1 40.19,20.38 v42.02,22.21 | SJ2.1 v22.73,13.84
  Bottom 0.61: v9.53,67.69 9.4,67.69 5.08,63.37 5.08,51.82 TDB-05.+ | L2.1 38.23,18.92 v37.59,18.29
ADC2/I-AKT  (via drill 0.5)
  Top 0.254: v26.67,56.13 18.03,56.13 17.14,57.02 17.14,65.41 v17.53,65.79 17.53,67.18 17.11,67.6 U$2.26
  Bottom 0.254: IC11.IS 27.56,58.93 27.18,58.55 27.18,56.64 v26.67,56.13 | v17.53,65.79 R19.2
ADC3/I-12V  (via drill 0.5)
  Top 0.254: U$2.14 2.36,68.4 1.91,67.94 1.91,63.25 2.29,62.87 4.12,62.87 5.01,61.98 R13.2 5.01,61.53 3.68,60.2 3.68,49.78 v4.57,48.9 | v17.14,30.23 17.14,40.77 16.64,41.27 16.64,45.59 v16.76,45.72
  Bottom 0.254: IC10.IS 27.18,23.11 26.8,22.73 24.64,22.73 v17.14,30.23 | v4.57,48.9 7.75,45.72 v16.76,45.72
ADC5/I-KICK  (via drill 0.5)
  Top 0.254: IC12.IS 25.91,61.21 25.53,60.83 25.53,56.9 25.27,56.64 18.29,56.64 17.65,57.28 17.65,64.52 18.41,65.28 18.41,67.44 v17.53,68.33 17.46,68.4 U$2.27
  Bottom 0.254: v17.53,68.33 R14.2
ADC6/I-MOT  (via drill 0.5)
  Top 0.254: U$2.13 4.97,69.2 v4.45,69.72
  Bottom 0.254: 6.6,74.67 4.94,74.67 4.45,74.17 v4.45,69.72 | R20.2 6.6,74.67 | 6.6,74.67 6.6,75.44 7.11,75.95 18.71,75.95 IC4.4
ADC7/I-EXT  (via drill 0.5)
  Top 0.254: U$2.16 5.46,66.8 5.01,66.36 R21.2 5.01,64.33 11.18,58.17 v11.18,57.02
  Bottom 0.254: IC15.IS 29.46,52.07 27.94,53.59 25.4,53.59 23.11,55.88 14.73,55.88 13.59,57.02 v11.18,57.02
ADC8/12VIN  (via drill 0.5)
  Top 0.254: v21.72,52.58 R2.2 | U$2.17 8.5,61.85 12.06,58.29 12.06,55.75 v12.95,54.86
  Bottom 0.254: R2.2 v21.72,52.58 21.72,54.48 21.34,54.86 v12.95,54.86
ADC9/EXT  (via drill 0.5)
  Top 0.254: v23.88,52.58 R10.2 | U$2.18 9.3,62.07 12.95,58.42 v12.95,56.13
  Bottom 0.254: R10.2 v23.88,52.58 23.88,53.47 21.97,55.37 13.72,55.37 v12.95,56.13
ADC10/24VIN  (via drill 0.5)
  Top 0.254: U$2.22 12.5,63.43 v12.45,63.37
  Bottom 0.254: R11.1 R9.2 12.45,62.04 v12.45,63.37
AKTUATOR  (via drill 0.5)
  Top 0.254: v35.94,48.01 35.94,60.08 P6.3 | v32.64,21.21 v34.92,21.21
  Bottom 0.254: R17.1 v34.92,21.21 34.92,24 36.7,25.78 36.7,30.73 36.45,30.99 36.45,47.5 v35.94,48.01 | R_NULL_2.1 9.14,26.04 13.97,21.21 v32.64,21.21
  Bottom 0.813: IC11.OUT1 30.99,62.36 31.18,62.17 P6.3 31.37,59.68 31.37,59.31 29.85,57.79 IC11.OUT2
CANH
  Bottom 0.254: U$1.7 5.59,16.26 7.37,18.03 9.27,18.03 10.74,19.5 RJ_1.P$2 | RJ_1.P$2 | RJ_2.P$2 23.76,20.57 13.96,20.57 RJ_1.P$2 | R6.1 15.43,18.09 14.02,19.5 RJ_1.P$2
CANL
  Bottom 0.254: U$1.6 6.86,15.37 8.64,17.14 9.65,17.14 10.79,18.29 13.47,18.29 RJ_1.P$3 16.77,14.99 19.18,14.99 SJ1.1 22.35,16.38 22.86,15.88 25.64,15.88 RJ_2.P$3
EXT  (via drill 1)
  Top 1.27: D11.A 28.7,43.81 | D10.A 28.7,43.81 | 28.7,43.81 v28.7,47.88
  Bottom 0.813: IC15.OUT1 26.04,48.38 26.54,47.88 v28.7,47.88 30.1,47.88 30.61,48.39 IC15.OUT2
EXTIN
  Bottom 0.254: IC15.TAB 25.89,45.78 R45.2 R10.1 | R1.1 28.32,8.64 27.56,9.4 27.56,12.06 29.72,14.22 29.72,17.65 29.97,17.91 29.97,19.18 30.48,19.68 33.15,19.68 33.53,20.07 33.53,28.83 35.94,31.24 35.94,39.45 P1.4
  Bottom 0.406: D1.A 30.24,41.42 30.35,41.53
  Bottom 2.54: P1.4 30.35,41.53 30.14,41.53 IC15.TAB
GND  (via drill 0.5)
  other vias: 11.3,67.31 9.53,71.88 13.08,71.88 42.04,12.19 9.78,44.83 14.86,44.83 5.08,44.7 9.91,49.66 12.45,53.47 8.51,84.84 6.1,76.45 21.59,36.58 21.72,47.37 32.64,25.53 32.64,29.59 20.95,23.62 23.75,25.91
  pour Bottom: 0,99.82 53.34,99.82 53.34,0 0,0
  pour Top: 0,99.82 53.34,99.82 53.34,0 0,0
ICLED_AKT  (via drill 0.5)
  Top 0.254: v38.35,1.14 GELB.C 38.26,2.63 37.21,3.68 32.89,3.68 32.13,4.45 v32.13,17.02 | U$2.30 17.07,70.8 v18.29,72.01 | v15.75,65.02 15.24,64.52 15.24,63.37 15.62,62.99 15.62,52.96 17.78,50.8 17.78,48.9 18.16,48.51 18.16,45.09 17.65,44.58 17.65,42.04 18.54,41.15 18.54,22.99 20.32,21.21 28.45,21.21 v30.86,18.8
  Bottom 0.254: T6.3 v38.35,1.14 | v15.75,65.02 15.75,69.47 v18.29,72.01 | v30.86,18.8 32.13,17.53 v32.13,17.02
ICLED_GRUEN  (via drill 0.5)
  Top 0.254: v42.93,1.14 GRÜN.C 42.93,3.68 44.58,3.68 44.96,4.06 44.96,10.54 44.7,10.79 43.31,10.79 42.93,11.18 42.93,18.29 41.15,20.07 31.88,20.07 29.21,22.73 20.57,22.73 19.56,23.75 19.56,41.91 18.67,42.8 18.67,44.07 19.18,44.58 19.18,48.51 19.56,48.9 19.56,49.78 16.13,53.21 v16.13,63.88 | U$2.28 17,69.2 v18.03,70.23
  Bottom 0.254: v42.93,1.14 T7.3 | v18.03,70.23 16.64,68.83 16.64,64.39 v16.13,63.88
ICLED_KICK  (via drill 0.5)
  Top 0.254: KICK.C v40.64,1.14 | U$2.24 14.1,62.62 14.61,62.1 14.61,50.67 v14.1,50.16 | v42.04,14.22 42.04,18.41 40.89,19.56 31.5,19.56 28.83,22.23 20.19,22.23 19.05,23.37 19.05,41.53 18.16,42.42 18.16,44.32 18.67,44.83 v18.67,49.28
  Bottom 0.254: v40.64,1.14 40.64,3.68 | 40.64,3.68 T2.3 | 40.64,3.68 44.58,3.68 44.96,4.06 44.96,10.41 44.58,10.79 43.94,10.79 43.69,11.05 43.69,12.57 v42.04,14.22 | v14.1,50.16 14.99,49.28 v18.67,49.28
ICLED_ROT  (via drill 0.5)
  Top 0.254: ROT.C v36.07,1.14 | U$2.23 13.3,62.39 14.1,61.59 14.1,51.44 13.21,50.55 13.21,49.66 v14.1,48.77 | v17.14,48.26 17.65,47.75 17.65,45.34 17.14,44.83 17.14,41.66 18.03,40.77 18.03,22.61 19.94,20.7 28.19,20.7 29.08,19.81 v29.08,18.41
  Bottom 0.254: v36.07,1.14 36.07,3.68 | 36.07,3.68 T5.3 | 36.07,3.68 27.3,3.68 27.05,3.94 27.05,8.64 26.8,8.89 26.8,12.32 29.08,14.61 v29.08,18.41 | v17.14,48.26 16.64,48.77 v14.1,48.77
KICKER  (via drill 0.5)
  Top 0.254: P6.4 34.54,57.29 34.54,47.24 v37.34,44.45 | v32.64,24.13 v36.45,24.13
  Top 0.813: IC12.OUT2 29.85,62.35 31.37,60.83 31.37,60.47 P6.4 31.3,57.98 31.11,57.78 IC12.OUT1
  Bottom 0.254: v37.34,44.45 36.96,44.07 36.96,31.24 37.21,30.99 37.21,24.89 v36.45,24.13 35.81,23.5 35.81,15.62 36.96,14.48 R23.1 | R_NULL_1.1 15.62,22.23 30.73,22.23 v32.64,24.13
LED_BLAU  (via drill 0.5)
  Top 0.254: v10.03,15.62 10.03,31.11 11.18,32.26 11.18,35.81 10.41,36.58 SV2.9
  Bottom 0.254: T4.C 25.02,10.54 22.73,12.83 12.83,12.83 v10.03,15.62
LED_GELB
  Bottom 0.254: SV2.5 9.14,28.7 R_NULL_2.2
LED_GRUEN
  Bottom 0.254: SV2.7 9.78,30.61 10.18,30.61 R_NULL_4.2
LED_KICK
  Bottom 0.254: SV4.9 14.61,35.31 R_NULL_1.2
LED_ROT
  Bottom 0.254: SV2.3 7.62,27.69 R_NULL_3.2
MOTION  (via drill 0.5)
  Top 0.254: v36.7,22.86 33.02,22.86 v32.64,22.48
  Top 3.81: IC4.5 26.27,72.12 28.19,74.04 28.19,81.79 28.72,82.32 | IC4.1 28.72,82.32 | 28.72,82.32 32.38,85.98 33.78,85.98 | 33.78,85.98 33.86,85.9 P8.4 | P8.3 33.86,85.98 33.78,85.98
  Bottom 0.254: R15.1 39.31,14.41 36.7,17.02 v36.7,22.86 37.72,23.88 37.72,28.07 49.28,39.62 49.28,80.01 48.77,80.52 37.22,80.52 P8.4 | R_NULL_4.1 10.29,25.78 14.35,21.72 31.88,21.72 v32.64,22.48
N$1
  Bottom 0.254: R5.2 10.29,56.01 10.86,55.44 T1.1
N$2
  Bottom 0.254: RJ_2.P$4 26.47,18.29 23.5,18.29 22.23,19.56 15.8,19.56 RJ_1.P$4
  Bottom 0.406: SJ2.2 28.07,15.88 28.07,19.12 RJ_2.P$4
N$4
  Bottom 0.254: R23.2 37.21,12.45 39.5,10.16 39.5,9.8 T2.1
N$5
  Top 0.254: R29.2 KICK.A
N$6
  Bottom 0.254: U$1.8 4.32,10.98 R31.2
N$7
  Bottom 0.254: R6.2 18.23,16.2 19.56,17.53 20.19,17.53 SJ1.2
N$8
  Top 0.254: R25.2 GELB.A
N$9
  Top 0.254: R26.2 ROT.A
N$10
  Top 0.254: Q1.2 3.68,84.62 C10.2 4.57,82.13 4.57,72.14 5.91,70.8 U$2.11
N$11
  Top 0.254: Q1.1 13.34,84.62 C11.2 11.64,82.26 11.18,81.79 5.59,81.79 5.21,81.41 5.21,72.39 5.97,71.63 6.98,71.63 U$2.10
N$12  (via drill 0.5)
  Top 0.254: v33.4,52.2 32,53.59 20.83,53.59 20.45,53.21 v17.53,53.21 | JP2.2 6.22,41.27 6.48,41.53 6.48,43.81 v9.53,46.86
  Bottom 0.254: VR7.3 35.31,50.29 v33.4,52.2 | v17.53,53.21 15.88,53.21 v9.53,46.86
N$13  (via drill 0.5)
  Top 0.254: U$2.21 11.7,66.19 v13.08,67.56
  Bottom 0.254: v13.08,67.56 C14.2
N$14
  Bottom 0.254: R1.2 28.18,4.78 T3.1
N$15
  Top 0.254: R4.2 LED_BLAU.A
N$16  (via drill 0.5)
  Top 0.254: v33.78,1.14 LED_BLAU.C
  Bottom 0.254: v33.78,1.14 T3.3 23.58,2.58 22.99,3.17 R7.1
N$17
  Bottom 0.254: R7.2 23.92,6.79 T4.B
N$18  (via drill 0.5)
  Top 0.254: OK1.2 23.11,42.8 22.48,43.43 v19.56,43.43
  Bottom 0.254: v19.56,43.43 8.64,43.43 6.48,41.27 JP5.2
N$19  (via drill 0.5)
  Top 0.254: v33.4,54.1 v19.81,54.1 | JP3.2 14.48,42.04 15.88,43.43 15.88,50.16 v16.51,50.8
  Bottom 0.254: VR8.3 v33.4,54.1 | v16.51,50.8 v19.81,54.1
N$20
  Bottom 0.254: TDB-05.- 7.24,57.23 T1.3
N$21
  Top 0.254: R27.2 GRÜN.A
N$22  (via drill 0.5)
  Top 0.406: C2.+ 46.86,15.61 U1.7
  Top 0.61: v46.86,20.32 U1.7
  Bottom 0.61: F1.2 45.47,27.18 46.86,25.78 v46.86,20.32
N$23  (via drill 0.5)
  Top 0.254: VR9.3 30.95,94.95 15.88,79.88 15.88,79.38 14.99,78.49 14.99,75.56 v15.75,74.8 | JP4.2 10.16,42.04 11.05,42.93 11.05,55.88 10.29,56.64 10.29,57.66 v7.49,60.45
  Bottom 0.254: v15.75,74.8 15.75,70.87 14.73,69.85 14.73,66.55 13.97,65.79 8.64,65.79 6.73,63.88 6.73,61.21 v7.49,60.45
N$24
  Top 0.254: R28.2 12V.A
N$25
  Bottom 0.254: R12.1 23.82,36.07 D3.K D1.K
N$26
  Top 0.254: OK1.4 20.57,37.85 20.95,37.47 23.11,37.47 24.38,38.73 OK1.1
N$27  (via drill 0.5)
  Top 0.254: U1.8 48.42,17.86 C4.2
  Top 0.406: U1.8 48.13,16.26 v48.51,15.88
  Bottom 0.406: D2.K 50.06,14.33 v48.51,15.88 50.49,17.85 L2.2
N$28  (via drill 0.5)
  Top 0.254: v21.84,38.48 OK1.3
  Bottom 0.254: R12.2 22.04,38.29 v21.84,38.48
N$29
  Top 0.254: U1.1 48.42,22.78 C4.1
N$30  (via drill 0.5)
  Top 0.254: v23.11,32.51 OK1.7
  Bottom 0.254: VR6.1 21.14,32.58 21.46,32.26 22.86,32.26 v23.11,32.51
N$31  (via drill 0.5)
  Top 0.254: OK1.6 21.84,35.31 25.27,38.73 25.27,45.97 25.53,46.23 25.53,51.94 25.91,52.32 v27.18,52.32
  Bottom 0.254: IC15.IN v27.18,52.32
N$32  (via drill 0.5)
  Top 0.254: OK1.8 24.38,28.19 v28.45,24.13
  Bottom 0.254: IC10.IN 28.55,24.03 v28.45,24.13
N$33
  Bottom 0.254: VR10.1 VR6.2 19.24,32.51 R30.2 R35.1
N$36  (via drill 0.5)
  Top 0.254: IC12.IN 27.82,58.93 27.56,58.67 27.56,56.64 v28.19,56.01
  Bottom 0.254: VR8.1 37.36,55.37 37.08,55.37 36.45,56.01 v28.19,56.01
N$37
  Top 0.254: IC4.2 19.99,82.61 30.14,92.75 VR9.1
N$40
  Bottom 0.254: IC11.IN 25.91,61.21 25.65,60.96 25.53,60.83 25.53,55.5 25.91,55.12 28.83,55.12 29.08,55.37 35.94,55.37 36.58,54.74 36.58,52.07 37.08,51.56 37.36,51.56 VR7.1
N$42
  Bottom 0.254: VR7.2 41.91,49.34 R37.1 R36.2
N$44
  Bottom 0.254: VR8.2 42.3,53.15 R38.2 R39.1
N$45
  Top 0.254: R40.2 R41.1 37.04,94.8 VR9.2
N$50
  Bottom 0.254: R45.1 R46.2 21.14,43.31 VR10.2
N$102
  Bottom 0.254: R16.2 32.64,12.45 34.92,10.16 34.92,9.8 T5.1
N$104
  Bottom 0.254: R17.2 34.92,11.56 35.18,11.3 37.34,11.3 38.1,10.54 38.1,8.51 37.4,7.81 T6.1
N$106
  Bottom 0.254: T7.1 41.98,8.32 41.78,8.51 40.89,8.51 40.64,8.76 40.64,11.37 R15.2
N$108
  Top 0.254: R18.1 5V.A
RST  (via drill 0.5)
  Top 0.254: v15.88,77.47 17.14,76.2 17.14,72.01 16.73,71.6 U$2.31
  Bottom 0.254: ISP.5 17.14,95 17.14,91.82 15.88,90.55 v15.88,77.47
RXCAN  (via drill 0.5)
  Top 0.254: U$2.7 9.3,78.96 v9.27,78.99
  Bottom 0.254: v9.27,78.99 8.26,80.01 1.91,80.01 1.65,79.76 1.65,24.13 3.94,21.84 7.75,21.84 8.13,21.46 U$1.4
SPEAKER  (via drill 0.5)
  Top 0.254: U$2.29 9.29,70 8.51,69.22 8.51,66.8 6.99,65.28 6.99,63.75 v7.62,63.12
  Bottom 0.254: 10.29,61.98 R5.1 8.83,61.91 v7.62,63.12
SW_1/SCK_A  (via drill 0.5)
  Top 0.254: U$2.12 5.82,70 3.81,72.01 v3.81,83.06
  Bottom 0.254: ISP.7 14.35,97.79 13.08,97.79 11.94,96.65 11.94,91.19 v3.81,83.06
SW_2/MOSI_A
  Top 0.254: U$2.2 13.3,79.98 24.89,91.57 24.89,94.87 ISP.1
SW_3/MISO_A  (via drill 0.5)
  Top 0.254: U$2.1 14.1,79.38 v14.61,79.88
  Bottom 0.254: ISP.9 14.61,95 v14.61,79.88
SW_12V  (via drill 0.5)
  Top 0.254: U$2.15 4.86,67.6 v4.83,67.56
  Bottom 0.254: SV2.4 5.08,30.23 5.08,37.21 | 5.08,37.21 3.68,38.61 3.68,66.42 4.32,67.06 v4.83,67.56 | 5.08,37.21 JP5.1
SW_AKT  (via drill 0.5)
  Top 0.254: U$2.8 8.5,78.36 v7.87,78.99 | JP2.1 2.54,39.75 2.16,39.37 2.16,33.15 SV2.6 5.08,32.77 v10.03,32.77
  Bottom 0.254: SV2.6 2.16,33.15 2.16,78.99 2.54,79.38 7.49,79.38 v7.87,78.99 | v10.03,32.77 10.41,33.15 SJ3.1
SW_BLAU  (via drill 0.5)
  Top 0.254: v11.94,77.47 12.5,76.91 U$2.3
  Bottom 0.254: SV2.10 3.17,37.21 3.17,77.09 3.56,77.47 v11.94,77.47
SW_KICK
  Top 0.254: SV4.10 JP3.1 13.08,40.77 12.7,40.77 12.06,41.4 12.06,44.58 15.11,47.62 15.11,62.61 14.73,62.99 14.73,66.29 15.23,66.8 U$2.25
  Bottom 0.254: SJ3.2 SV4.10
SW_MOT  (via drill 0.5)
  Top 0.254: U$2.9 7.01,78.08 v6.35,78.74 | JP4.1 9.53,40.51 7.37,38.35 5.71,38.35 5.08,37.72 5.08,35.31 SV2.8
  Bottom 0.254: SV2.8 2.67,35.18 2.67,78.49 2.92,78.74 v6.35,78.74
TXCAN  (via drill 0.5)
  Top 0.254: U$2.6 10.1,80.07 v9.53,80.64
  Bottom 0.254: U$1.1 4.32,20.7 1.14,23.88 1.14,80.14 1.65,80.64 v9.53,80.64
(copper drawn outside any net)
  shapes: Top area x2

### Text on the board
tNames: PowerSwitch CN 2016 | v1.0
Document: Speaker